# Altium schematic sheet Key_Pull-Up.SchDoc
size 76 x 55 mm
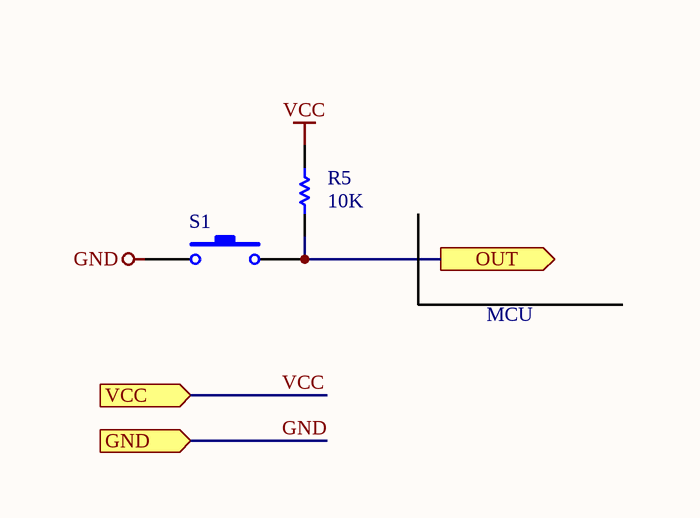
[diagram p0: Key_Pull-Up.SchDoc]

## Parts
R5  value 10K  [AXIAL-0.4]  (hidden comment: Res1)
S1  SW-PB  [SPST-2_2]  (value not drawn)

## Ports
GND, OUT (out), VCC

## Nets
GND: S1.1 ; port GND
VCC: R5.1 ; port VCC
OUT: R5.2 S1.2 ; port OUT

## Notes on the sheet
- MCU

## Library data of the parts
R5 = Res1: Resistor; Manufacturer: Generic Components; Class I: Passive; Published: 8-Jun-2000; Revision: July-2002: Re-released for DXP Platform.; Publisher: Altium Limited; Class II: Resistor
S1 = SW-PB: Switch; Manufacturer: Generic Components; Published: 24-Mar-1999; Revision: July-2002: Re-released for DXP Platform.; Publisher: Altium Limited